# EAGLE design FootKeyboardLite (EAGLE 7.5.0)
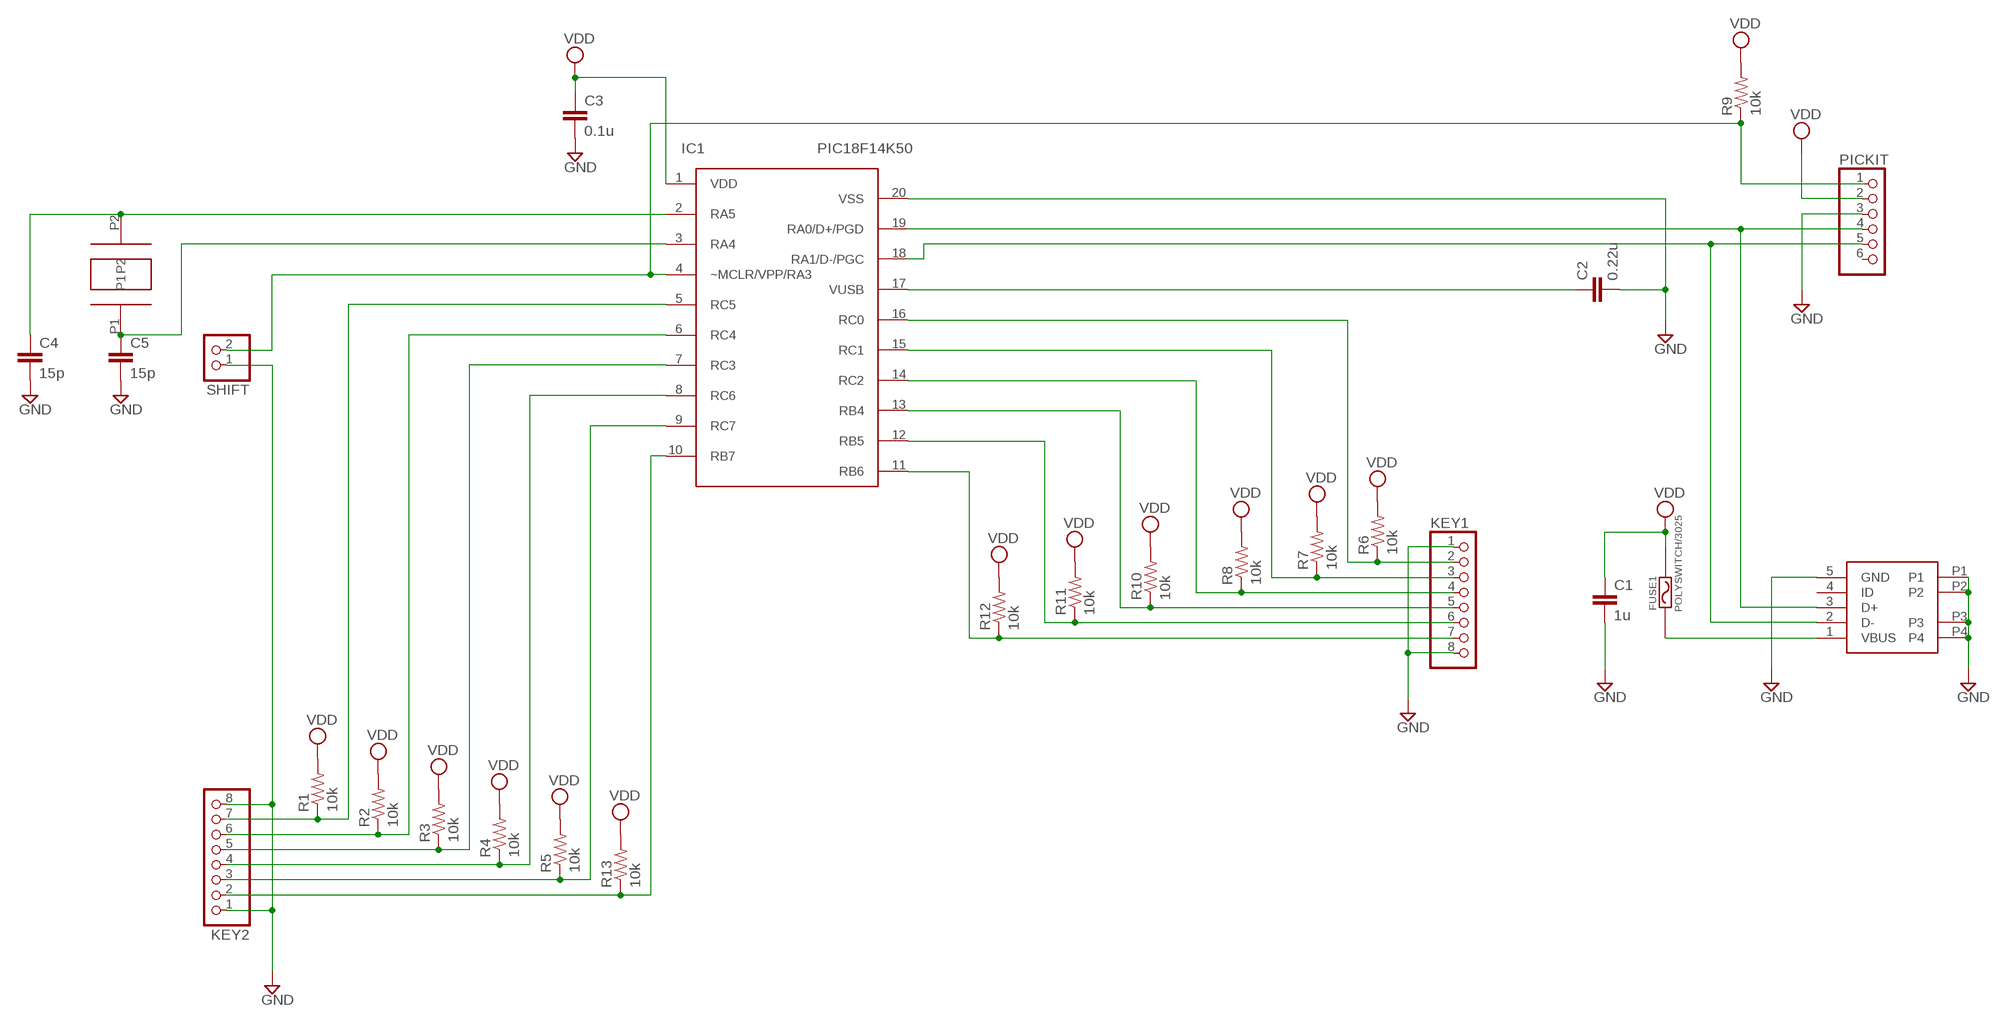
[diagram p0: schematic, sheet 1]

## Parts
C1  1u  C-EU025-025X050  [C025-025X050]
C2  0.22u  C-EU025-025X050  [C025-025X050]
C3  0.1u  C-EU025-025X050  [C025-025X050]
C4  15p  C-EU025-025X050  [C025-025X050]
C5  15p  C-EU025-025X050  [C025-025X050]
FUSE1  POLYSWITCH/3025  [SMD/30X25]
IC1  PIC18F14K50  PIC18F1XK50DIP  [DIL20]
KEY1  PINHD-1X8  [1X08]
KEY2  PINHD-1X8  [1X08]
PICKIT  PINHD-1X6  [1X06]
R1  10k  R-US_0204/7  [0204/7]
R2  10k  R-US_0204/7  [0204/7]
R3  10k  R-US_0204/7  [0204/7]
R4  10k  R-US_0204/7  [0204/7]
R5  10k  R-US_0204/7  [0204/7]
R6  10k  R-US_0204/7  [0204/7]
R7  10k  R-US_0204/7  [0204/7]
R8  10k  R-US_0204/7  [0204/7]
R9  10k  R-US_0204/7  [0204/7]
R10  10k  R-US_0204/7  [0204/7]
R11  10k  R-US_0204/7  [0204/7]
R12  10k  R-US_0204/7  [0204/7]
R13  10k  R-US_0204/7  [0204/7]
SHIFT  PINHD-1X2  [1X02]
USB  AKIZUKI-USB-MINI-B  [AKIZUKI-USB-MINI-B]
XTAL  12M  AKIZUKI-XTAL  [AKIZUKI-XTAL]

## Nets
GND: C1.2 C2.2 C3.2 C4.2 C5.2 IC1.20(VSS) KEY1.1 KEY1.8 KEY2.1 KEY2.8 PICKIT.3 SHIFT.1 USB.5(GND) USB.P1 USB.P2 USB.P3 USB.P4
N$1: IC1.19(RA0/D+/PGD) PICKIT.4 USB.3(D+)
N$2: C5.1 IC1.3(RA4) XTAL.P1
N$3: C4.1 IC1.2(RA5) XTAL.P2
N$4: IC1.18(RA1/D-/PGC) PICKIT.5 USB.2(D-)
N$5: IC1.5(RC5) KEY2.7 R1.1
N$6 [power]: FUSE1.P1 USB.1(VBUS)
N$7: IC1.6(RC4) KEY2.6 R2.1
N$8: IC1.4(~MCLR/VPP/RA3) PICKIT.1 R9.1 SHIFT.2
N$9: C2.1 IC1.17(VUSB)
N$10: IC1.7(RC3) KEY2.5 R3.1
N$11: IC1.8(RC6) KEY2.4 R4.1
N$12: IC1.9(RC7) KEY2.3 R5.1
N$13: IC1.10(RB7) KEY2.2 R13.1
N$17: IC1.16(RC0) KEY1.2 R6.1
N$18: IC1.15(RC1) KEY1.3 R7.1
N$19: IC1.14(RC2) KEY1.4 R8.1
N$20: IC1.13(RB4) KEY1.5 R10.1
N$21: IC1.12(RB5) KEY1.6 R11.1
N$22: IC1.11(RB6) KEY1.7 R12.1
VDD [power]: C1.1 C3.1 FUSE1.P2 IC1.1(VDD) PICKIT.2 R1.2 R2.2 R3.2 R4.2 R5.2 R6.2 R7.2 R8.2 R9.2 R10.2 R11.2 R12.2 R13.2
Unconnected: PICKIT.6 USB.4(ID)

## Library data of the parts
C1-C5 = MyParts:C-EU: CAPACITOR, European symbol
FUSE1 = MyOriginal:POLYSWITCH/3025
IC1 = MyOriginal:PIC18F1XK50: PIC18F1XK50
KEY1 KEY2 = MyOriginal:PINHD-1X8: PIN HEADER
PICKIT = MyParts:PINHD-1X6: PIN HEADER
R1-R13 = MyParts:R-US_: RESISTOR, American symbol
SHIFT = MyOriginal:PINHD-1X2: PIN HEADER
USB = MyOriginal:AKIZUKI-USB-MINI-B
XTAL = MyOriginal:AKIZUKI-XTAL

## Net classes
0 default: width 0.229 mm, clearance 0.203 mm
1 power: width 0.381 mm, clearance 0.203 mm

## Board
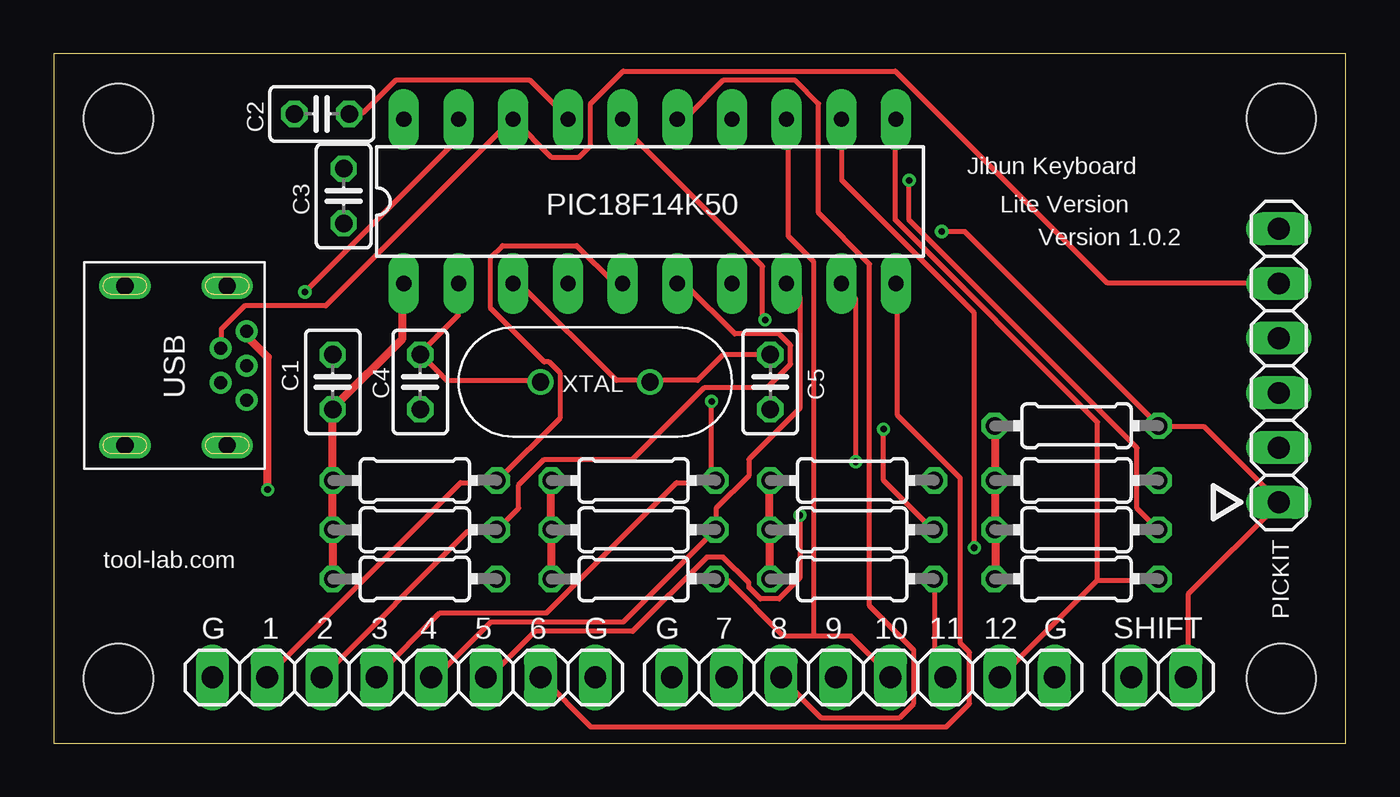
[diagram p1: board, top side]
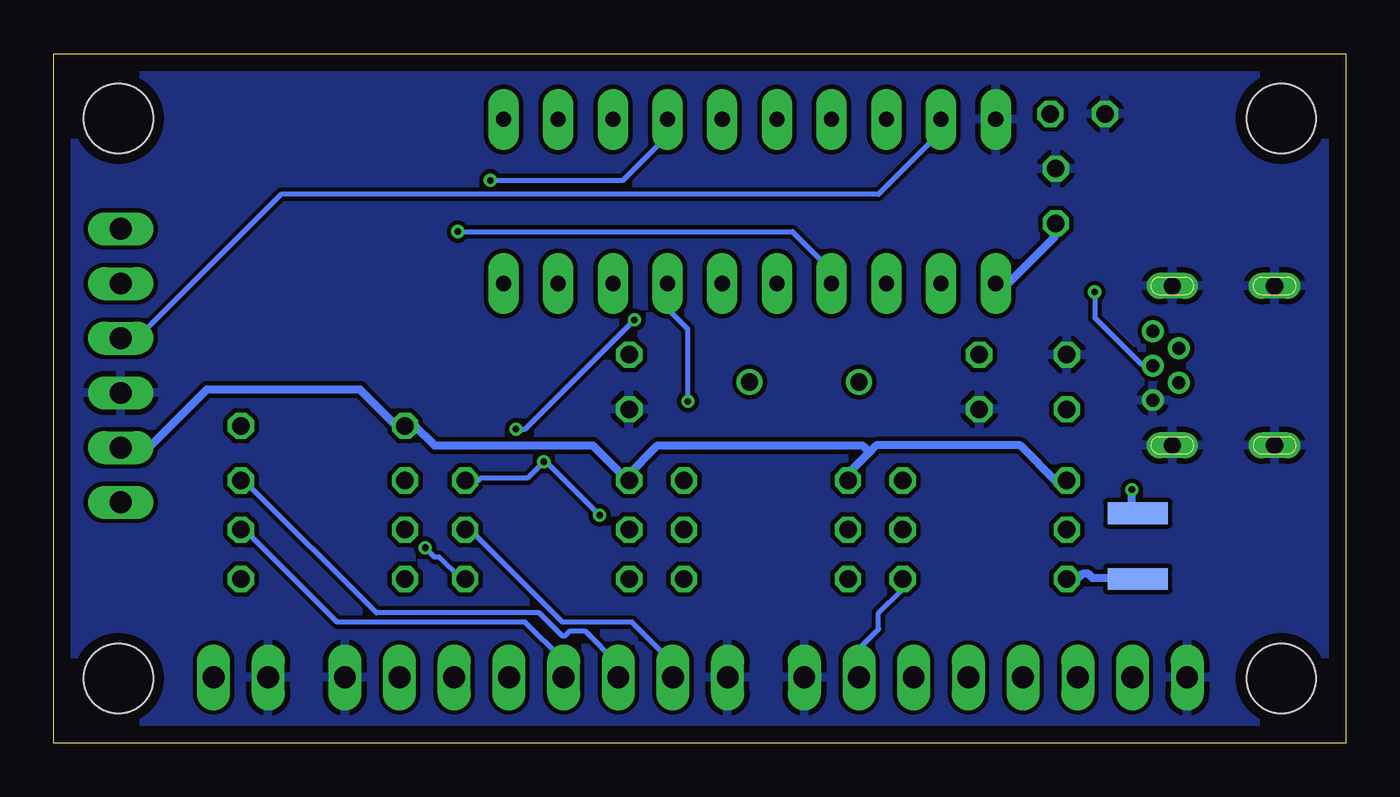
[diagram p2: board, bottom side, seen from below]

Size 60 x 32 mm. Coordinates in mm from the lower left corner, seen from the top.
Outline: 0,0 60,0 60,32 0,32 0,0
Copper layers (1*16): Top 0.035mm / dielectric 1.6mm / Bottom 0.035mm
Design rules "Elecrow_2-layer_PCB_eagle_rule": minimum track width 6mil, minimum drill 12mil, track to track 6mil, track to pad 6mil, pad to pad 6mil, via to via 8mil, smd to smd 0mil, copper to edge 20mil, drill to drill 10mil, minimum pad ring 6mil, minimum via ring 6mil, stop-mask expansion 0mil, vias tented up to drill 100mil, thermal gap 10mil
Holes 3.2 mm at 3,3 57,3 57,29 3,29

### Footprints (pad centres in the part's own frame; a part is rotated, then mirrored left to right if it is on the bottom)
C025-025X050 = drill 0.813 octagon: 1 -1.27,0; 2 1.27,0
SMD/30X25 = smd 1.016 x 2.794: P1 -1.524,0; P2 1.524,0
DIL20 = drill 0.7 pad 1.422 long: 1 -10.16,-3.81; 2 -7.62,-3.81; 3 -5.08,-3.81; 4 -2.54,-3.81; 5 0,-3.81; 6 2.54,-3.81; 7 5.08,-3.81; 8 7.62,-3.81; 9 10.16,-3.81; 10 12.7,-3.81; 11 12.7,3.81; 12 10.16,3.81; 13 7.62,3.81; 14 5.08,3.81; 15 2.54,3.81; 16 0,3.81; 17 -2.54,3.81; 18 -5.08,3.81; 19 -7.62,3.81; 20 -10.16,3.81
1X08 = drill 1.016 long: 1 -8.89,0; 2 -6.35,0; 3 -3.81,0; 4 -1.27,0; 5 1.27,0; 6 3.81,0; 7 6.35,0; 8 8.89,0
1X06 = drill 1.016 long: 1 -6.35,0; 2 -3.81,0; 3 -1.27,0; 4 1.27,0; 5 3.81,0; 6 6.35,0
0204/7 = drill 0.813 octagon: 1 -3.81,0; 2 3.81,0
1X02 = drill 1.016 long: 1 -1.27,0; 2 1.27,0
AKIZUKI-USB-MINI-B = drill 0.6 pad 1.016: 1 -1.6,5.65; 2 -0.8,4.45; 3 0,5.65; 4 0.8,4.45; 5 1.6,5.65 | drill 0.8 long: P1 -3.7,4.75; P2 -3.7,0; P3 3.7,0; P4 3.7,4.75
AKIZUKI-XTAL = drill 0.8: P1 -2.54,0; P2 2.54,0

### Placement (x,y rotation side)
C1  12.95,16.76 90 top
C2  12.45,29.21 180 top
C3  13.46,25.4 90 top
C4  17.02,16.76 270 top
C5  33.27,16.76 270 top
FUSE1  9.65,9.14 270 bottom
IC1  26.42,25.15 0 top
KEY1  37.59,3.05 0 top
KEY2  16.26,3.05 180 top
PICKIT  56.9,17.53 90 top
R1  16.76,12.19 180 top
R2  16.76,9.91 180 top
R3  26.92,12.19 180 top
R4  26.92,9.91 180 top
R5  37.08,12.19 180 top
R6  37.08,9.91 180 top
R7  47.5,12.19 180 top
R8  47.5,9.91 180 top
R9  47.5,14.73 180 top
R10  26.92,7.62 180 top
R11  37.08,7.62 180 top
R12  47.5,7.62 180 top
R13  16.76,7.62 180 top
SHIFT  51.31,3.05 0 top
USB  3.3,17.53 270 top
XTAL  25.15,16.76 180 top

### Tracks (layer width: path | path; a pad name or v marks a point on that pad's centre or on a via)
GND
  pour Bottom: 1,31 1,1 59,1 59,31
N$1  (via drill 0.3)
  Top 0.229: v11.66,20.94 18.78,28.07 18.78,28.93 IC1.19
  Bottom 0.229: v11.66,20.94 11.66,19.75 9.5,17.6 8.96,17.6 USB.3 | PICKIT.4 56.89,18.89 56.03,18.89 49.44,25.48 21.7,25.48 18.89,28.28 18.89,28.93 IC1.19
N$2
  Top 0.229: C5.1 33.25,18.03 31.09,18.03 29.9,16.84 27.74,16.84 XTAL.P1 27.64,16.84 26.12,16.84 21.7,21.27 21.37,21.27 IC1.3
N$3
  Top 0.229: XTAL.P2 22.56,16.84 18.24,16.84 17.06,18.03 C4.1 17.06,18.14 18.78,19.86 18.78,21.27 IC1.2
N$4
  Top 0.229: USB.2 7.77,18.35 7.77,19.21 8.85,20.3 12.63,20.3 21.27,28.93 IC1.18 21.37,28.93 23.1,27.2 24.4,27.2 24.94,27.74 24.94,29.69 26.45,31.2 39.08,31.2 48.9,21.37 56.89,21.37 PICKIT.5
N$5
  Top 0.229: KEY2.7 9.93,3.13 18.89,12.09 20.51,12.09 R1.1 20.62,12.2 23.53,15.11 23.53,17.16 22.99,17.7 22.78,17.7 20.3,20.19 20.3,22.56 20.83,23.1 24.29,23.1 26.02,21.37 26.34,21.37 IC1.5
N$6  (via drill 0.3)
  Top 0.381: v9.93,11.77 9.93,17.92 8.96,18.89 8.96,19.11 USB.1
  Bottom 0.381: v9.93,11.77 9.93,10.9 9.72,10.69 FUSE1.P1
N$7
  Top 0.229: KEY2.6 12.52,3.13 19.21,9.82 20.51,9.82 R2.1 20.62,9.93 21.59,10.9 21.59,11.98 22.78,13.17 26.88,13.17 30.23,16.52 33.14,16.52 34.22,17.6 34.22,18.46 33.68,19 31.63,19 29.36,21.27 29.04,21.27 IC1.6
N$8  (via drill 0.3)
  Top 0.229: v41.24,23.75 42.32,23.75 51.28,14.79 R9.1 51.38,14.68 53.44,14.68 56.89,11.23 PICKIT.1 56.89,11.12 52.68,6.91 52.68,3.13 SHIFT.2
  Bottom 0.229: v41.24,23.75 25.69,23.75 23.96,22.02 23.96,21.37 IC1.4
N$9
  Top 0.229: C2.1 13.82,29.25 14.36,29.25 15.87,30.77 22.13,30.77 23.86,29.04 IC1.17
N$10  (via drill 0.3)
  Top 0.229: KEY2.5 15.01,3.13 17.92,6.04 22.89,6.04 28.93,12.09 30.66,12.09 R3.1 30.55,12.2 v30.55,15.87
  Bottom 0.229: v30.55,15.87 30.55,19.21 31.41,20.08 31.41,21.27 IC1.7
N$11
  Top 0.229: IC1.8 34.11,21.27 34.65,20.73 34.65,15.54 32.28,13.17 32.28,12.41 30.77,10.9 30.77,9.93 R4.1 30.66,9.82 26.45,5.61 20.3,5.61 17.81,3.13 17.6,3.13 KEY2.4
N$12  (via drill 0.3)
  Top 0.229: v37.24,13.06 37.24,20.62 36.59,21.27 IC1.9 | v34.65,10.58 34.65,7.66 33.68,6.69 32.82,6.69 32.28,7.23 32.28,7.45 31.09,8.64 30.33,8.64 26.88,5.18 22.35,5.18 20.3,3.13 20.08,3.13 KEY2.3
  Bottom 0.229: R5.1 40.8,12.2 40.27,12.2 40.16,12.31 38,12.31 v37.24,13.06 37.13,13.06 v34.65,10.58
N$13
  Top 0.229: IC1.10 39.19,21.27 39.19,15.22 42.1,12.31 42.1,4.64 42.53,4.21 42.53,1.83 41.45,0.76 24.94,0.76 22.67,3.02 KEY2.2
  Bottom 0.229: R13.1 20.62,7.56 20.62,7.12 21.7,6.04 21.7,5.29 22.56,4.43 22.56,3.13 KEY2.2
N$17  (via drill 0.3)
  Top 0.229: v33.03,19.65 32.92,19.75 32.92,22.13 26.45,28.61 26.45,28.93 IC1.16 | v38.54,14.57 38.54,12.2 40.8,9.93 R6.1
  Bottom 0.229: R6.1 40.8,9.82 40.59,9.82 36.38,5.61 33.14,5.61 31.3,3.78 31.3,3.13 KEY1.2 | v33.03,19.65 38.11,14.57 v38.54,14.57
N$18
  Top 0.229: IC1.15 29.04,29.04 29.36,29.04 31.09,30.77 34.44,30.77 35.52,29.69 35.52,24.61 37.89,22.24 37.89,6.37 39.94,4.32 39.94,1.83 39.29,1.19 35.62,1.19 33.79,3.02 KEY1.3
  Bottom 0.229: R7.1 51.28,12.09 51.06,12.09 45.02,6.04 37.46,6.04 36.38,4.97 36.27,4.97 36.05,5.18 35.3,5.18 33.79,3.67 33.79,3.13 KEY1.3
N$19  (via drill 0.3)
  Top 0.229: v39.73,26.12 39.73,24.29 50.3,13.71 50.3,10.9 51.28,9.93 R8.1
  Bottom 0.229: R8.1 51.28,9.82 51.06,9.82 46.85,5.61 38.11,5.61 36.38,3.89 36.38,3.13 KEY1.4 | v39.73,26.12 33.57,26.12 31.52,28.18 31.52,28.93 IC1.14
N$20
  Top 0.229: 35.3,4.97 37.03,4.97 38.86,3.13 KEY1.5 | 35.3,4.97 33.9,4.97 31.3,7.56 30.77,7.56 R10.1 | 35.3,4.97 35.3,22.35 34.11,23.53 34.11,28.93 IC1.13
N$21  (via drill 0.3)
  Top 0.229: R11.1 40.91,7.56 40.91,3.56 41.34,3.13 KEY1.6 | v42.75,9.07 42.75,19.97 36.59,26.12 36.59,28.93 IC1.12
  Bottom 0.229: v42.75,9.07 42.32,8.64 42.1,8.64 41.13,7.66 40.91,7.66 R11.1
N$22
  Top 0.229: 48.47,7.56 51.28,7.56 R12.1 | 48.47,7.56 44.04,3.13 KEY1.7 | 48.47,7.56 48.47,14.9 39.08,24.29 39.08,28.93 IC1.11
VDD
  Top 0.381: R10.2 23.1,7.66 23.1,9.82 R4.2 23.1,10.04 23.1,12.09 R3.2 | R13.2 R2.2 R1.2 C1.1 13.06,15.65 16.19,18.78 16.19,21.27 IC1.1 | R11.2 33.25,7.66 33.25,9.82 R6.2 33.25,10.04 33.25,12.09 R5.2 | R12.2 43.72,7.66 43.72,9.82 R8.2 43.72,10.04 43.72,12.09 R7.2 43.72,12.31 43.72,14.68 R9.2
  Bottom 0.381: C3.1 13.49,24.07 13.49,23.53 15.65,21.37 16.19,21.37 IC1.1 | FUSE1.P2 9.72,7.66 11.77,7.66 11.98,7.88 12.2,7.88 12.52,7.56 12.95,7.56 R13.2 | 22.13,13.49 21.81,13.82 15.11,13.82 13.39,12.09 12.95,12.09 R1.2 | 22.13,13.49 23.1,12.52 R3.2 | PICKIT.2 56.89,13.82 55.49,13.82 52.9,16.41 45.77,16.41 44.15,14.79 43.72,14.79 R9.2 43.5,14.79 43.29,14.79 42.32,13.82 34.98,13.82 33.36,12.2 R5.2 33.36,12.41 31.95,13.82 22.45,13.82 22.13,13.49

### Text on the board
tPlace: Jibun Keyboard | Lite Version | Version 1.0.2 | USB | tool-lab.com | G | 1 | 2 | 3 | 4 | 5 | 6 | G | G | 7 | 8 | 9 | 10 | 11 | 12 | G